# EAGLE design xr_vco_components_manual_rt1-V2 (EAGLE 7.3.0)
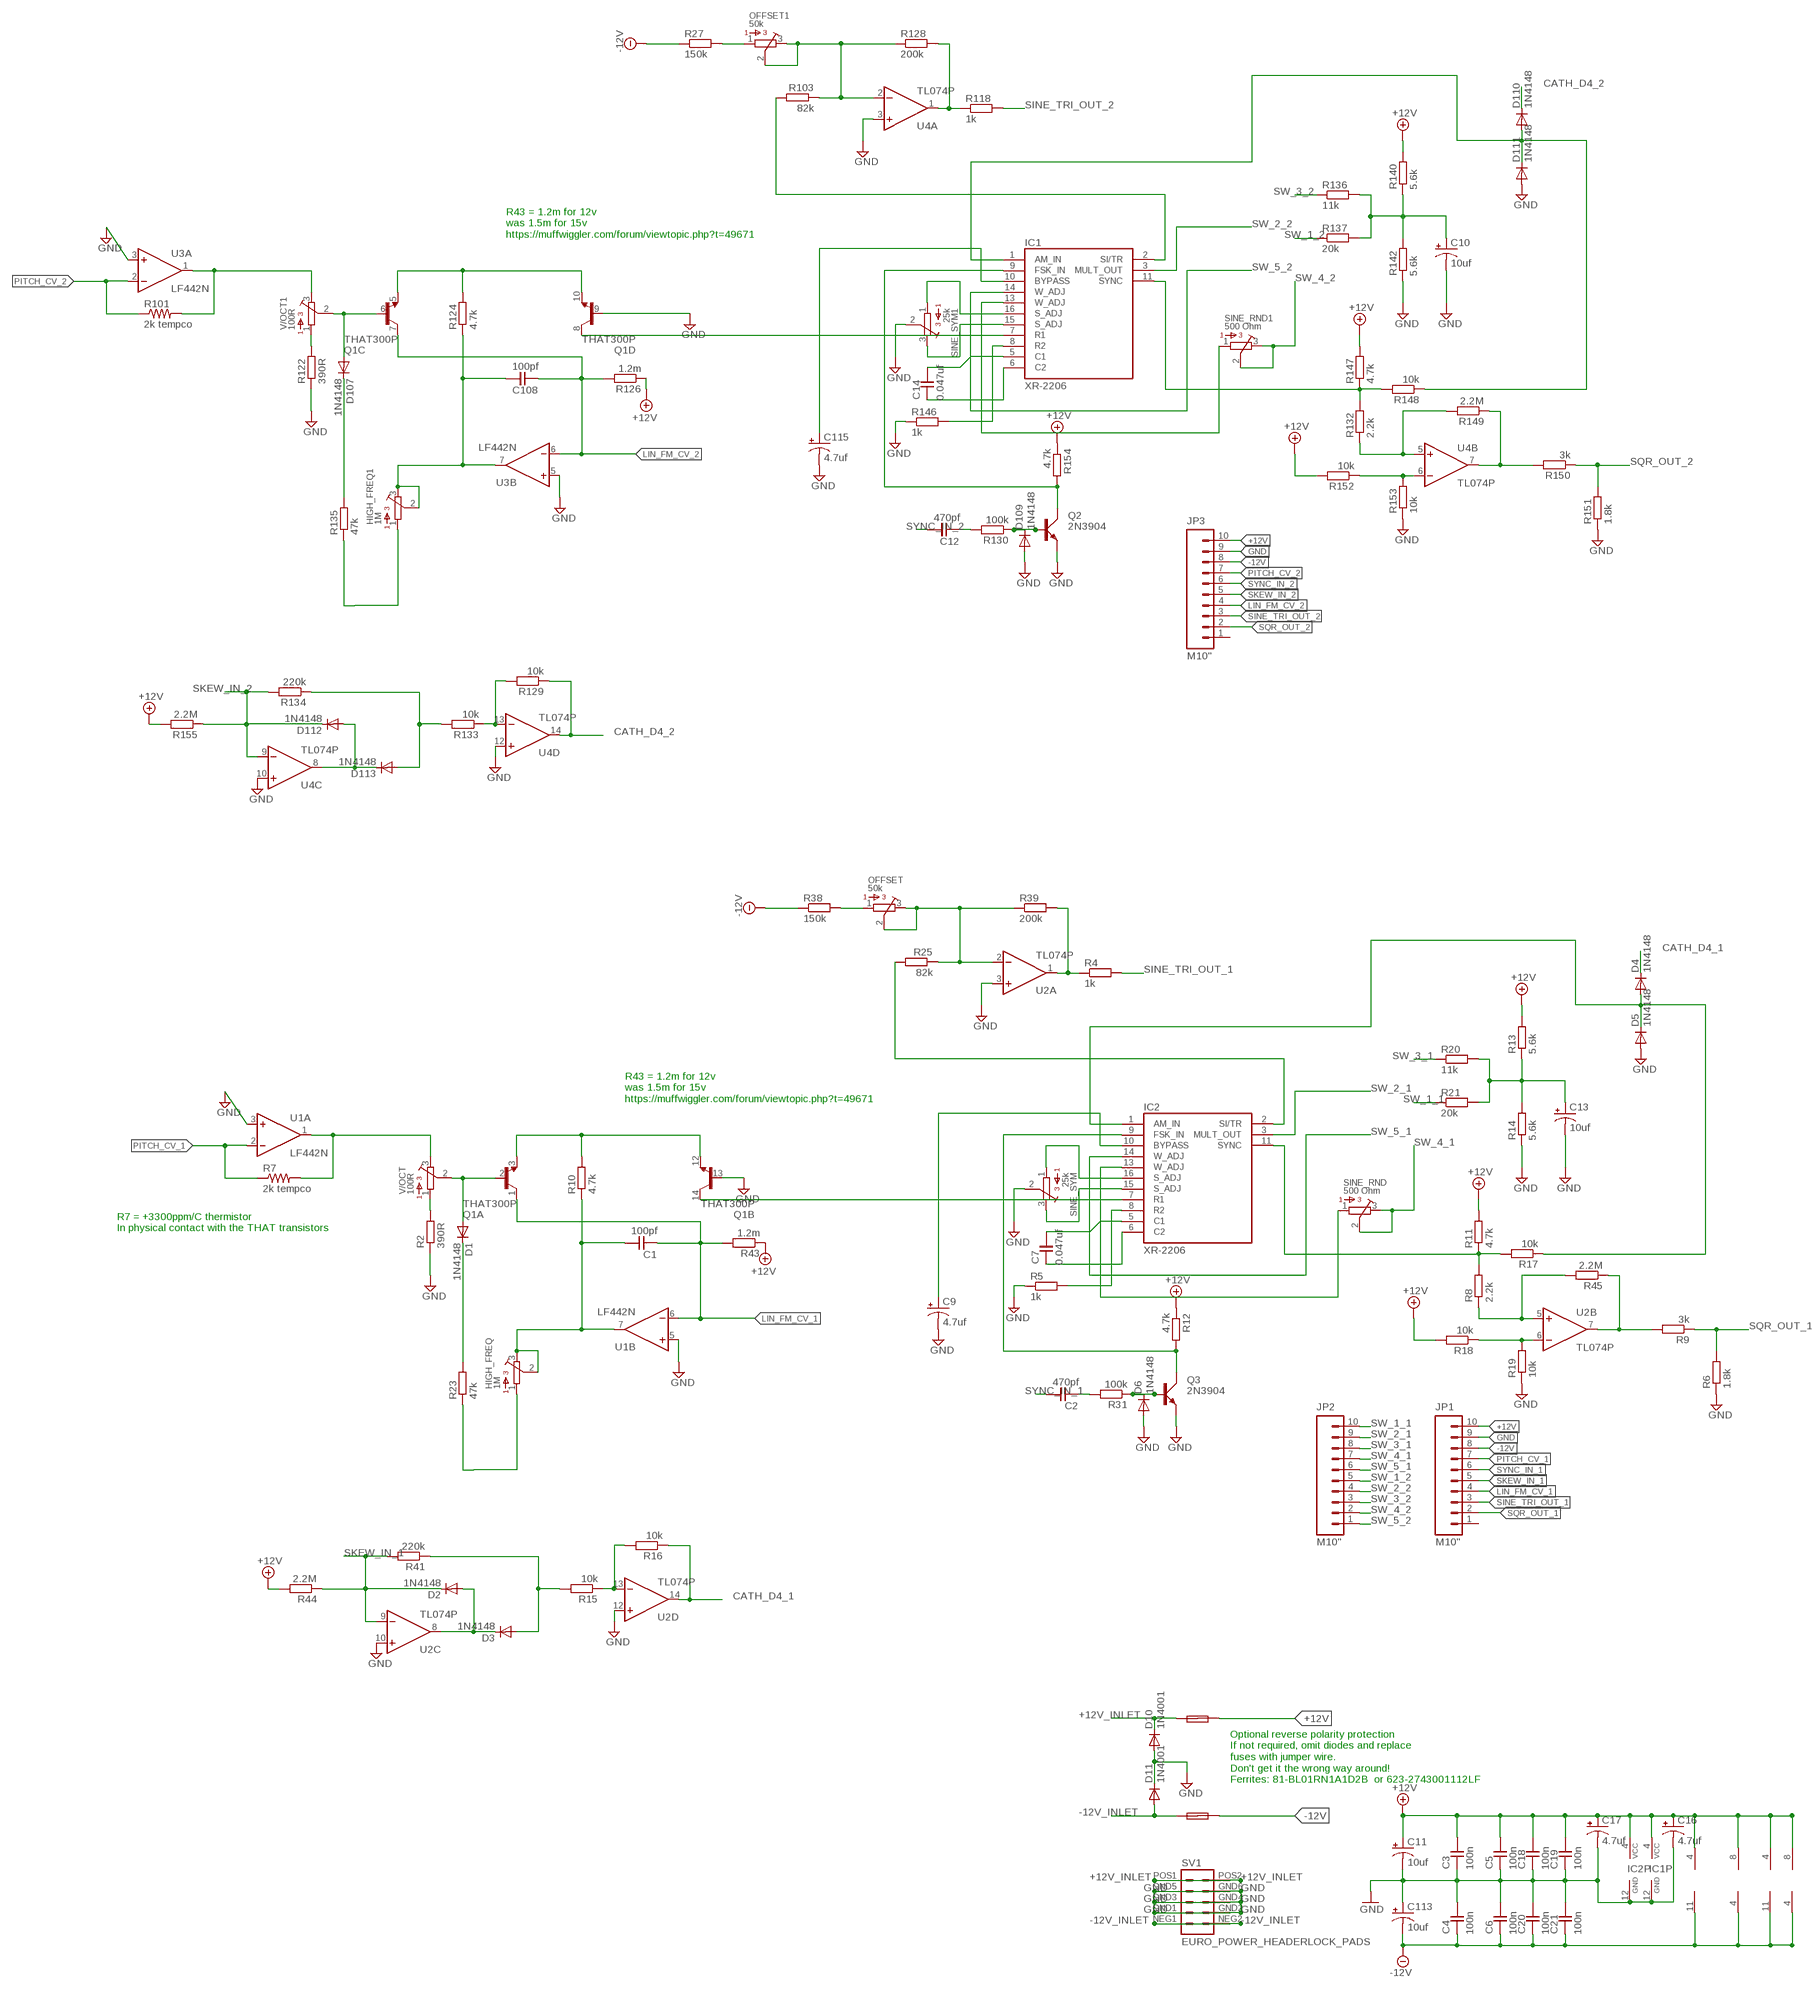
[diagram p0: schematic, sheet 1]

## Parts
C1  100pf  C-EU050-024X044  [C050-024X044]
C2  470pf  C-EU050-024X044  [C050-024X044]
C3  100n  C-EU050-024X044  [C050-024X044]
C4  100n  C-EU050-024X044  [C050-024X044]
C5  100n  C-EU050-024X044  [C050-024X044]
C6  100n  C-EU050-024X044  [C050-024X044]
C7  0.047uf  C-EU050-024X044  [C050-024X044]
C9  4.7uf  CAP_POLPTH2  [CPOL-RADIAL-10UF-25V]
C10  10uf  CAP_POLPTH2  [CPOL-RADIAL-10UF-25V]
C11  10uf  CAP_POLPTH2  [CPOL-RADIAL-10UF-25V]
C12  470pf  C-EU050-024X044  [C050-024X044]
C13  10uf  CAP_POLPTH2  [CPOL-RADIAL-10UF-25V]
C14  0.047uf  C-EU050-024X044  [C050-024X044]
C16  4.7uf  CAP_POLPTH2  [CPOL-RADIAL-10UF-25V]
C17  4.7uf  CAP_POLPTH2  [CPOL-RADIAL-10UF-25V]
C18  100n  C-EU050-024X044  [C050-024X044]
C19  100n  C-EU050-024X044  [C050-024X044]
C20  100n  C-EU050-024X044  [C050-024X044]
C21  100n  C-EU050-024X044  [C050-024X044]
C108  100pf  C-EU050-024X044  [C050-024X044]
C113  10uf  CAP_POLPTH2  [CPOL-RADIAL-10UF-25V]
C115  4.7uf  CAP_POLPTH2  [CPOL-RADIAL-10UF-25V]
D1  1N4148  SMALL_DIODEDO35-7  [DO35-7]
D2  1N4148  SMALL_DIODEDO35-7  [DO35-7]
D3  1N4148  SMALL_DIODEDO35-7  [DO35-7]
D4  1N4148  SMALL_DIODEDO35-7  [DO35-7]
D5  1N4148  SMALL_DIODEDO35-7  [DO35-7]
D6  1N4148  SMALL_DIODEDO35-7  [DO35-7]
D10  1N4001  1N4004  [DO41-10]
D11  1N4001  1N4004  [DO41-10]
D107  1N4148  SMALL_DIODEDO35-7  [DO35-7]
D109  1N4148  SMALL_DIODEDO35-7  [DO35-7]
D110  1N4148  SMALL_DIODEDO35-7  [DO35-7]
D111  1N4148  SMALL_DIODEDO35-7  [DO35-7]
D112  1N4148  SMALL_DIODEDO35-7  [DO35-7]
D113  1N4148  SMALL_DIODEDO35-7  [DO35-7]
F1  FUSE  PTC_FUSEPOLY_FUSE  [C050H075X075]
F2  FUSE  PTC_FUSEPOLY_FUSE  [C050H075X075]
HIGH_FREQ  1M  BOURNS_3362P_TRIMMERP  [BOURNS_3362P_TRIMMER]
HIGH_FREQ1  1M  BOURNS_3362P_TRIMMERP  [BOURNS_3362P_TRIMMER]
IC1  XR-2206  [DIL16]
IC2  XR-2206  [DIL16]
JP1  M10"  [1X10]
JP2  M10"  [1X10]
JP3  M10"  [1X10]
OFFSET  50k  BOURNS_3362P_TRIMMERP  [BOURNS_3362P_TRIMMER]
OFFSET1  50k  BOURNS_3362P_TRIMMERP  [BOURNS_3362P_TRIMMER]
Q1  THAT300P  [DIL14]
Q2  2N3904  [TO92D]
Q3  2N3904  [TO92D]
R2  390R  RESISTOR7MM  [7MM_RESISTOR]
R4  1k  RESISTOR7MM  [7MM_RESISTOR]
R5  1k  RESISTOR7MM  [7MM_RESISTOR]
R6  1.8k  RESISTOR7MM  [7MM_RESISTOR]
R7  2k tempco  R-US_0309/12  [0309/12]
R8  2.2k  RESISTOR7MM  [7MM_RESISTOR]
R9  3k  RESISTOR7MM  [7MM_RESISTOR]
R10  4.7k  RESISTOR7MM  [7MM_RESISTOR]
R11  4.7k  RESISTOR7MM  [7MM_RESISTOR]
R12  4.7k  RESISTOR7MM  [7MM_RESISTOR]
R13  5.6k  RESISTOR7MM  [7MM_RESISTOR]
R14  5.6k  RESISTOR7MM  [7MM_RESISTOR]
R15  10k  RESISTOR7MM  [7MM_RESISTOR]
R16  10k  RESISTOR7MM  [7MM_RESISTOR]
R17  10k  RESISTOR7MM  [7MM_RESISTOR]
R18  10k  RESISTOR7MM  [7MM_RESISTOR]
R19  10k  RESISTOR7MM  [7MM_RESISTOR]
R20  11k  RESISTOR7MM  [7MM_RESISTOR]
R21  20k  RESISTOR7MM  [7MM_RESISTOR]
R23  47k  RESISTOR7MM  [7MM_RESISTOR]
R25  82k  RESISTOR7MM  [7MM_RESISTOR]
R27  150k  RESISTOR7MM  [7MM_RESISTOR]
R31  100k  RESISTOR7MM  [7MM_RESISTOR]
R38  150k  RESISTOR7MM  [7MM_RESISTOR]
R39  200k  RESISTOR7MM  [7MM_RESISTOR]
R41  220k  RESISTOR7MM  [7MM_RESISTOR]
R43  1.2m  RESISTOR7MM  [7MM_RESISTOR]
R44  2.2M  RESISTOR7MM  [7MM_RESISTOR]
R45  2.2M  RESISTOR7MM  [7MM_RESISTOR]
R101  2k tempco  R-US_0309/12  [0309/12]
R103  82k  RESISTOR7MM  [7MM_RESISTOR]
R118  1k  RESISTOR7MM  [7MM_RESISTOR]
R122  390R  RESISTOR7MM  [7MM_RESISTOR]
R124  4.7k  RESISTOR7MM  [7MM_RESISTOR]
R126  1.2m  RESISTOR7MM  [7MM_RESISTOR]
R128  200k  RESISTOR7MM  [7MM_RESISTOR]
R129  10k  RESISTOR7MM  [7MM_RESISTOR]
R130  100k  RESISTOR7MM  [7MM_RESISTOR]
R132  2.2k  RESISTOR7MM  [7MM_RESISTOR]
R133  10k  RESISTOR7MM  [7MM_RESISTOR]
R134  220k  RESISTOR7MM  [7MM_RESISTOR]
R135  47k  RESISTOR7MM  [7MM_RESISTOR]
R136  11k  RESISTOR7MM  [7MM_RESISTOR]
R137  20k  RESISTOR7MM  [7MM_RESISTOR]
R140  5.6k  RESISTOR7MM  [7MM_RESISTOR]
R142  5.6k  RESISTOR7MM  [7MM_RESISTOR]
R146  1k  RESISTOR7MM  [7MM_RESISTOR]
R147  4.7k  RESISTOR7MM  [7MM_RESISTOR]
R148  10k  RESISTOR7MM  [7MM_RESISTOR]
R149  2.2M  RESISTOR7MM  [7MM_RESISTOR]
R150  3k  RESISTOR7MM  [7MM_RESISTOR]
R151  1.8k  RESISTOR7MM  [7MM_RESISTOR]
R152  10k  RESISTOR7MM  [7MM_RESISTOR]
R153  10k  RESISTOR7MM  [7MM_RESISTOR]
R154  4.7k  RESISTOR7MM  [7MM_RESISTOR]
R155  2.2M  RESISTOR7MM  [7MM_RESISTOR]
SINE_RND  500 Ohm  BOURNS_3362P_TRIMMERP  [BOURNS_3362P_TRIMMER]
SINE_RND1  500 Ohm  BOURNS_3362P_TRIMMERP  [BOURNS_3362P_TRIMMER]
SINE_SYM  25k  BOURNS_3362P_TRIMMERP  [BOURNS_3362P_TRIMMER]
SINE_SYM1  25k  BOURNS_3362P_TRIMMERP  [BOURNS_3362P_TRIMMER]
SV1  EURO_POWER_HEADERLOCK_PADS  [EURO_PWR_HEADER_LOCK]
U1  LF442N  [DIL08]
U2  TL074P  [DIL14]
U3  LF442N  [DIL08]
U4  TL074P  [DIL14]
V/OCT  100R  BOURNS_3362P_TRIMMERP  [BOURNS_3362P_TRIMMER]
V/OCT1  100R  BOURNS_3362P_TRIMMERP  [BOURNS_3362P_TRIMMER]

## Nets
+12V: C3.1 C5.1 C11.1(+) C16.1(+) C17.1(+) C18.1 C19.1 F1.2 IC1.4(VCC) IC2.4(VCC) JP1.10 JP3.10 R11.2 R12.1 R13.2 R18.2 R43.1 R44.2 R126.1 R140.2 R147.2 R152.2 R154.1 R155.2 U1.8(P:V+) U2.4(P:V+) U3.8(P:V+) U4.4(P:V+)
+12V_INLET [power]: D10.C F1.1 SV1.POS1 SV1.POS2
-12V: C4.2 C6.2 C20.2 C21.2 C113.2(-) F2.2 JP1.8 JP3.8 R27.1 R38.1 U1.4(P:V-) U2.11(P:V-) U3.4(P:V-) U4.11(P:V-)
-12V_INLET [power]: D11.A F2.1 SV1.NEG1 SV1.NEG2
CATH_D4_1: D4.C R16.1 U2.14(D:OUT)
CATH_D4_2: D110.C R129.1 U4.14(D:OUT)
GND: C3.2 C4.1 C5.2 C6.1 C9.2(-) C10.2(-) C11.2(-) C13.2(-) C16.2(-) C17.2(-) C18.2 C19.2 C20.1 C21.1 C113.1(+) C115.2(-) D5.A D6.A D10.A D11.C D109.A D111.A IC1.12(GND) IC2.12(GND) JP1.9 JP3.9 Q1.9(D:B) Q1.13(B:B) Q2.E Q3.E R2.1 R5.1 R6.1 R14.1 R19.1 R122.1 R142.1 R146.1 R151.1 R153.1 SINE_SYM1.2 SINE_SYM.2 SV1.GND1 SV1.GND2 SV1.GND3 SV1.GND4 SV1.GND5 SV1.GND6 U1.3(A:+IN) U1.5(B:+IN) U2.3(A:+IN) U2.10(C:+IN) U2.12(D:+IN) U3.3(A:+IN) U3.5(B:+IN) U4.3(A:+IN) U4.10(C:+IN) U4.12(D:+IN)
LIN_FM_CV_1: C1.2 JP1.4 Q1.1(A:C) R43.2 U1.6(B:-IN)
LIN_FM_CV_2: C108.2 JP3.4 Q1.7(C:C) R126.2 U3.6(B:-IN)
N$1: IC2.7(R1) Q1.14(B:C)
N$2: D1.C R23.2
N$3: HIGH_FREQ.1 R23.1
N$4: R101.2 U3.1(A:OUT) V/OCT1.3
N$5: IC2.2(SI/TR) R25.2
N$6: R122.2 V/OCT1.1
N$7: R7.2 U1.1(A:OUT) V/OCT.3
N$8: OFFSET.2 OFFSET.3 R25.1 R39.1 U2.2(A:-IN)
N$9: R2.2 V/OCT.1
N$10: D1.A Q1.2(A:B) V/OCT.2
N$11: Q1.3(A:E) Q1.12(B:E) R10.2
N$12: OFFSET.1 R38.2
N$13: R4.1 R39.2 U2.1(A:OUT)
N$14: D107.A Q1.6(C:B) V/OCT1.2
N$15: C1.1 HIGH_FREQ.2 HIGH_FREQ.3 R10.1 U1.7(B:OUT)
N$16: C13.1(+) R13.1 R14.2 R20.2 R21.2
N$17: IC2.16(S_ADJ) SINE_SYM.1
N$18: Q1.5(C:E) Q1.10(D:E) R124.2
N$19: C108.1 HIGH_FREQ1.2 HIGH_FREQ1.3 R124.1 U3.7(B:OUT)
N$20: IC2.13(W_ADJ) SINE_RND.1
N$21: IC2.15(S_ADJ) SINE_SYM.3
N$22: IC2.8(R2) R5.2
N$23: R18.1 R19.2 U2.6(B:-IN)
N$24: R9.2 R45.1 U2.7(B:OUT)
N$25: R15.1 R16.2 U2.13(D:-IN)
N$26: R8.1 R45.2 U2.5(B:+IN)
N$27: D4.A D5.C IC2.1(AM_IN) R17.1
N$28: C2.2 R31.2
N$29: D6.C Q3.B R31.1
N$30: IC2.11(SYNC) R8.2 R11.1 R17.2
N$31: IC2.9(FSK_IN) Q3.C R12.2
N$32: C7.2 IC2.6(C2)
N$33: C7.1 IC2.5(C1)
N$34: C9.1(+) IC2.10(BYPASS)
N$35: D2.A D3.C U2.8(C:OUT)
N$36: D3.A R15.2 R41.1
N$37: IC1.7(R1) Q1.8(D:C)
N$38: HIGH_FREQ1.1 R135.1
N$39: D107.C R135.2
N$40: IC1.2(SI/TR) R103.2
N$41: OFFSET1.2 OFFSET1.3 R103.1 R128.1 U4.2(A:-IN)
N$42: OFFSET1.1 R27.2
N$43: R118.1 R128.2 U4.1(A:OUT)
N$44: C10.1(+) R136.2 R137.2 R140.1 R142.2
N$45: IC1.13(W_ADJ) SINE_RND1.1
N$46: IC1.16(S_ADJ) SINE_SYM1.1
N$47: IC1.15(S_ADJ) SINE_SYM1.3
N$48: IC1.8(R2) R146.2
N$49: R152.1 R153.2 U4.6(B:-IN)
N$50: R149.1 R150.2 U4.7(B:OUT)
N$51: R132.1 R149.2 U4.5(B:+IN)
N$52: IC1.11(SYNC) R132.2 R147.1 R148.2
N$53: D110.A D111.C IC1.1(AM_IN) R148.1
N$54: C12.2 R130.2
N$55: D109.C Q2.B R130.1
N$56: IC1.9(FSK_IN) Q2.C R154.2
N$57: C14.2 IC1.6(C2)
N$58: C14.1 IC1.5(C1)
N$59: R129.2 R133.1 U4.13(D:-IN)
N$60: D112.A D113.C U4.8(C:OUT)
N$61: D113.A R133.2 R134.1
N$62: C115.1(+) IC1.10(BYPASS)
PITCH_CV_1: JP1.7 R7.1 U1.2(A:-IN)
PITCH_CV_2: JP3.7 R101.1 U3.2(A:-IN)
SINE_TRI_OUT_1: JP1.3 R4.2
SINE_TRI_OUT_2: JP3.3 R118.2
SKEW_IN_1: D2.C JP1.5 R41.2 R44.1 U2.9(C:-IN)
SKEW_IN_2: D112.C JP3.5 R134.2 R155.1 U4.9(C:-IN)
SQR_OUT_1: JP1.2 R6.2 R9.1
SQR_OUT_2: JP3.2 R150.1 R151.2
SW_1_1: JP2.10 R21.1
SW_1_2: JP2.5 R137.1
SW_2_1: IC2.3(MULT_OUT) JP2.9
SW_2_2: IC1.3(MULT_OUT) JP2.4
SW_3_1: JP2.8 R20.1
SW_3_2: JP2.3 R136.1
SW_4_1: JP2.7 SINE_RND.2 SINE_RND.3
SW_4_2: JP2.2 SINE_RND1.2 SINE_RND1.3
SW_5_1: IC2.14(W_ADJ) JP2.6
SW_5_2: IC1.14(W_ADJ) JP2.1
SYNC_IN_1: C2.1 JP1.6
SYNC_IN_2: C12.1 JP3.6
Unconnected: JP1.1 JP3.1

## Notes on the sheet
- R43 = 1.2m for 12v
  was 1.5m for 15v
  https://muffwiggler.com/forum/viewtopic.php?t=49671
- R43 = 1.2m for 12v
  was 1.5m for 15v
  https://muffwiggler.com/forum/viewtopic.php?t=49671
- R7 = +3300ppm/C thermistor
  In physical contact with the THAT transistors
- Optional reverse polarity protection
  If not required, omit diodes and replace
  fuses with jumper wire. 
  Don't get it the wrong way around! 
  Ferrites: 81-BL01RN1A1D2B  or 623-2743001112LF

## Library data of the parts
C1-C7 C12 C14 C18-C21 C108 = TomW:C-EU: CAPACITOR, European symbol
C9-C11 C13 C16 C17 C113 C115 = SparkFun-Passives:CAP_POL: Capacitor Polarized These are standard SMD and PTH capacitors. Normally 10uF, 47uF, and 100uF in electrolytic and tantalum varieties. Always verify the external diameter of the through hole cap, it varies with capacity, voltage, and manufacturer. The EIA devices should be standard.
D1-D6 D107 D109-D113 = MusicThingModular:SMALL_DIODE: Small Signal Diode
D10 D11 = diode:1N4004: DIODE general purpose rectifier, 1 A
F1 F2 = TomW:PTC_FUSE
HIGH_FREQ HIGH_FREQ1 OFFSET OFFSET1 SINE_RND SINE_RND1 SINE_SYM SINE_SYM1 V/OCT V/OCT1 = MusicThingModular:BOURNS_3362P_TRIMMER: 3362 Series 1/4" Square Trimmer
IC1 IC2 = exar:XR-2206: Monolithic FUNCTION GENERATOR; OC_FARNELL: unknown; OC_NEWARK: unknown
JP1-JP3 = SparkFun-Connectors:M10: Header 10 Standard 10-pin 0.1" header. Use with straight break away headers (SKU : PRT-00116), right angle break away headers (PRT-00553), swiss pins (PRT-00743), machine pins (PRT-00117), and female headers (PRT-00115).
Q1 = that-corp:THAT300: 4-Matched NPN Transistors
Q2 Q3 = transistor-small-signal:2N3904: NPN TRANSISTOR
R2 R4-R6 R8-R21 R23 R25 R27 R31 R38 R39 R41 R43-R45 R103 R118 R122 R124 R126 R128-R130 R132-R137 R140 R142 R146-R155 = MusicThingModular:RESISTOR: Standard resistor, various versions
R7 R101 = resistor:R-US_: RESISTOR, American symbol
SV1 = MusicThingModular:EURO_POWER_HEADER: Power Header 10 pin power header for Eurorack Power Supplies Variants with fatter pads for easier soldering, and the LOCK variant which has 5mil offset pins to hold the component in place before soldering
U1 U3 = linear:LF442: OP AMP
U2 U4 = linear:TL074: OP AMP

## Net classes
1 power: width 0.406 mm
2 ground: width 0.305 mm

## Board
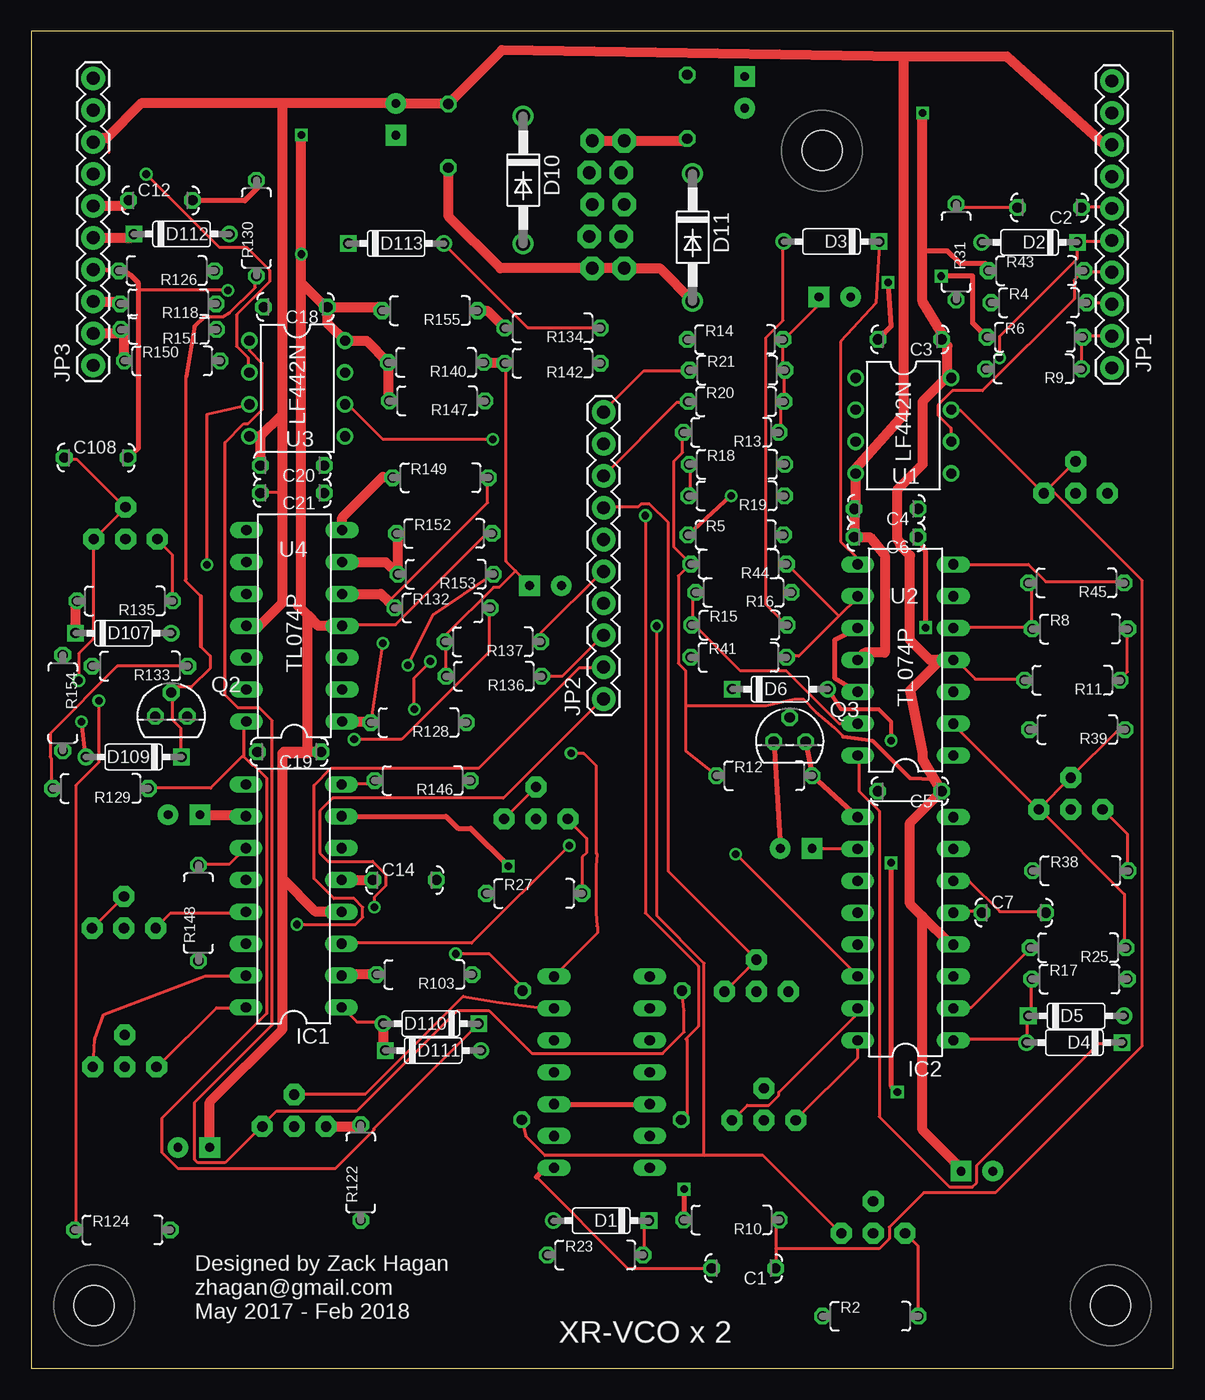
[diagram p1: board, top side]
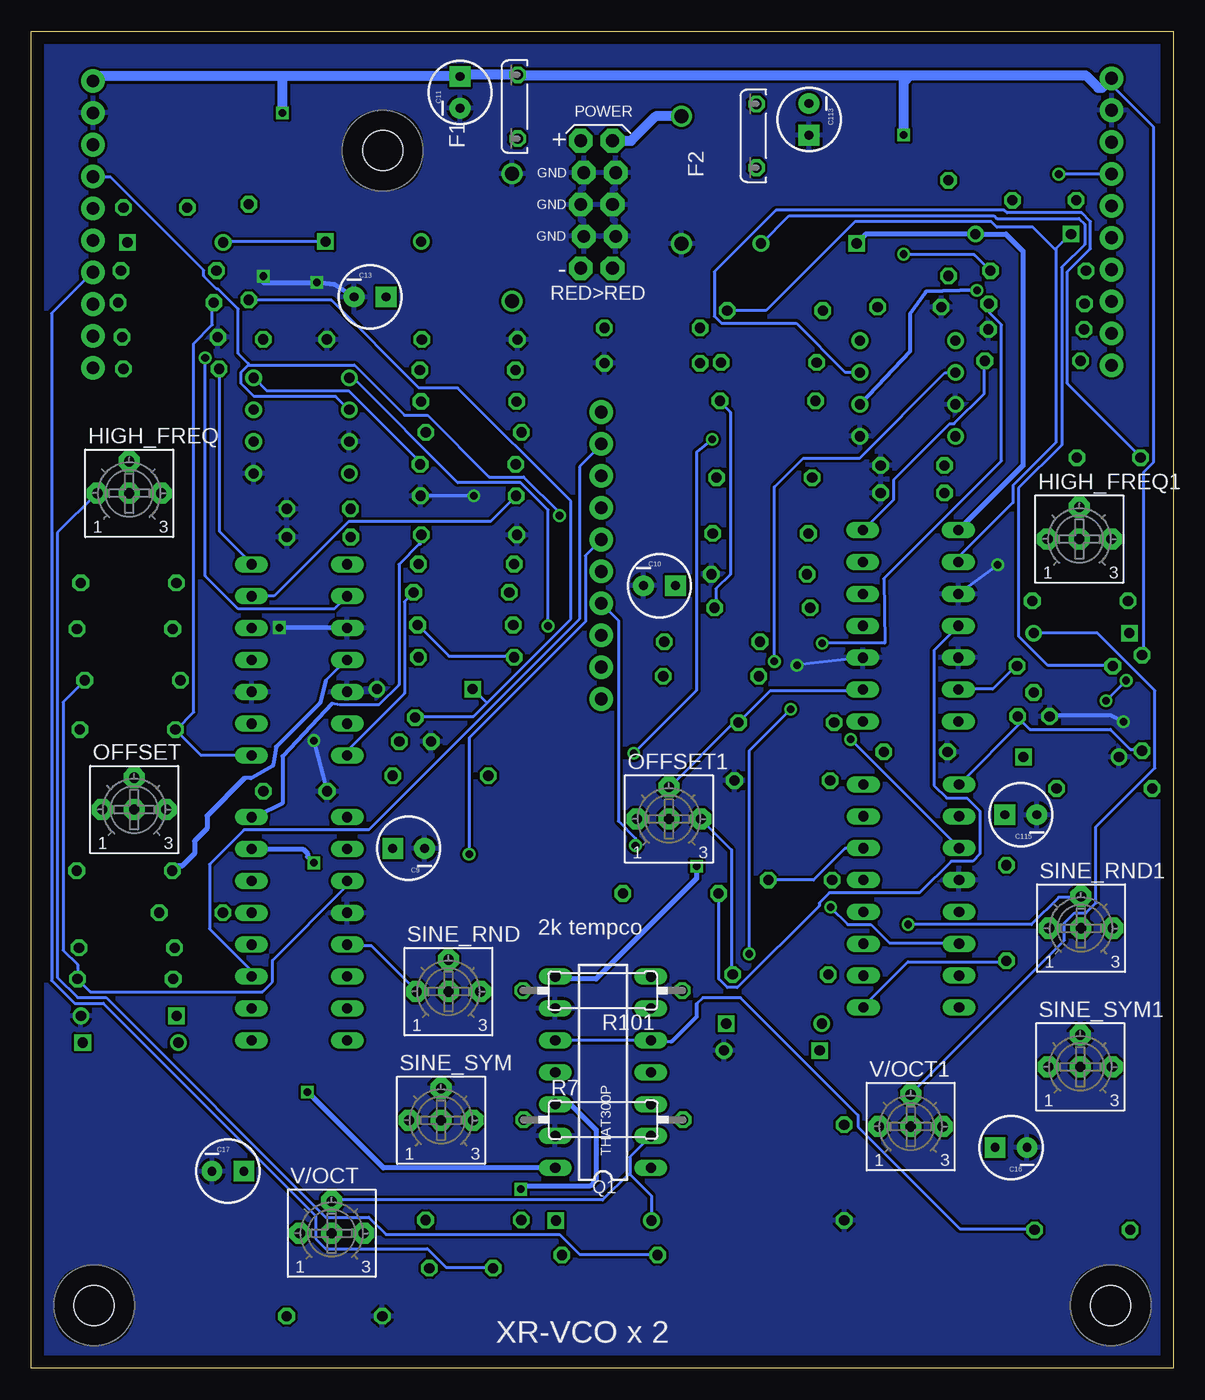
[diagram p2: board, bottom side, seen from below]

Size 91 x 106.5 mm. Coordinates in mm from the lower left corner, seen from the top.
Outline: 0,0 91,0 91,106.5 0,106.5 0,0
Copper layers (1*16): Top 0.035mm / dielectric 1.5mm / Bottom 0.035mm
Design rules "default *": minimum track width 10mil, minimum drill 19mil, track to track 8mil, track to pad 8mil, pad to pad 8mil, via to via 8mil, smd to smd 8mil, copper to edge 40mil, drill to drill 8mil, minimum pad ring 10mil, minimum via ring 8mil, stop-mask expansion 4mil, vias tented up to drill 0mil, thermal gap 10mil

### Footprints (pad centres in the part's own frame; a part is rotated, then mirrored left to right if it is on the bottom)
C050-024X044 = drill 0.813 octagon: 1 -2.54,0; 2 2.54,0
CPOL-RADIAL-10UF-25V = drill 0.7 pad 1.651 square: 1 1.27,0 | drill 0.7 pad 1.651: 2 -1.27,0
DO35-7 = drill 0.813: A 3.81,0 | drill 0.813 square: C -3.81,0
DO41-10 = drill 1.118: A 5.08,0; C -5.08,0
C050H075X075 = drill 0.813 octagon: 1 -2.54,0; 2 2.54,0
BOURNS_3362P_TRIMMER = drill 0.813 pad 1.676 octagon: 1 -2.54,0; 2 0,2.54; 3 2.54,0; 4 0,0
DIL16 = drill 0.813 long: 1 -8.89,-3.81; 2 -6.35,-3.81; 3 -3.81,-3.81; 4 -1.27,-3.81; 5 1.27,-3.81; 6 3.81,-3.81; 7 6.35,-3.81; 8 8.89,-3.81; 9 8.89,3.81; 10 6.35,3.81; 11 3.81,3.81; 12 1.27,3.81; 13 -1.27,3.81; 14 -3.81,3.81; 15 -6.35,3.81; 16 -8.89,3.81
1X10 = drill 1.016 pad 1.88: 1 0,0; 2 2.54,0; 3 5.08,0; 4 7.62,0; 5 10.16,0; 6 12.7,0; 7 15.24,0; 8 17.78,0; 9 20.32,0; 10 22.86,0
DIL14 = drill 0.813 long: 1 -7.62,-3.81; 2 -5.08,-3.81; 3 -2.54,-3.81; 4 0,-3.81; 5 2.54,-3.81; 6 5.08,-3.81; 7 7.62,-3.81; 8 7.62,3.81; 9 5.08,3.81; 10 2.54,3.81; 11 0,3.81; 12 -2.54,3.81; 13 -5.08,3.81; 14 -7.62,3.81
TO92D = drill 0.813 octagon: B 0,1.905; C 1.27,0; E -1.27,0
7MM_RESISTOR = drill 0.813 octagon: 1 -3.81,0; 2 3.81,0
0309/12 = drill 0.813 octagon: 1 -6.35,0; 2 6.35,0
EURO_PWR_HEADER_LOCK = drill 1.016 pad 1.88 octagon: GND1 -2.54,1.143; GND2 -2.54,-1.397; GND3 0,1.397; GND4 0,-1.143; GND5 2.54,1.143; GND6 2.54,-1.397; NEG1 -5.08,1.397; NEG2 -5.08,-1.143; POS1 5.08,1.397; POS2 5.08,-1.143
DIL08 = drill 0.813 pad 1.27: 1 -3.81,-3.81; 2 -1.27,-3.81; 3 1.27,-3.81; 4 3.81,-3.81; 5 3.81,3.81; 6 1.27,3.81; 7 -1.27,3.81; 8 -3.81,3.81
MOUNTING_HOLE = hole 3.2: 0,0

### Placement (x,y rotation side)
C1  56.75,7.96 180 top
C2  81.12,92.46 180 top
C3  69.99,81.96 180 top
C4  68.11,68.46 180 top
C5  69.98,45.96 180 top
C6  68.1,66.21 180 top
C7  78.28,36.29 0 top
C9  60.94,41.41 180 bottom
C10  40.96,62.34 0 bottom
C11  56.84,101.64 90 bottom
C12  10.29,93.04 0 top
C13  64.01,85.34 0 bottom
C14  29.74,38.89 0 top
C16  12.94,17.58 180 bottom
C17  75.34,15.69 0 bottom
C18  21.04,84.54 180 top
C19  20.54,49.1 180 top
C20  20.79,71.91 180 top
C21  20.79,69.72 180 top
C108  5.16,72.54 0 top
C113  29.04,99.49 270 bottom
C115  12.16,44.09 180 bottom
D1  45.4,11.75 180 top
D2  79.53,89.69 180 top
D3  63.75,89.75 180 top
D4  83.1,25.94 180 top
D5  83.24,28.06 0 top
D6  59.65,54.1 0 top
D10  39.19,94.65 270 top
D11  52.69,90.1 270 top
D107  7.33,58.56 0 top
D109  8.15,48.69 180 top
D110  31.83,27.44 180 top
D111  32.01,25.31 0 top
D112  11.97,90.35 0 top
D113  29.06,89.6 0 top
F1  52.25,100.5 90 bottom
F2  33.22,98.18 90 bottom
HIGH_FREQ  83.2,69.7 0 bottom
HIGH_FREQ1  7.5,66.05 0 bottom
IC1  20.9,37.62 90 top
IC2  69.65,35.01 90 top
JP1  86.09,79.69 90 top
JP2  45.59,53.31 90 top
JP3  4.93,79.9 90 top
OFFSET  82.81,44.5 0 bottom
OFFSET1  40.2,43.75 0 bottom
Q1  45.45,23.57 90 bottom
Q2  11.14,51.92 0 top
Q3  60.42,49.92 0 top
R2  66.85,4.14 0 top
R4  80.28,84.89 0 top
R5  56.12,66.39 0 top
R6  79.96,82.14 0 top
R7  45.43,19.79 0 bottom
R8  83.55,58.89 0 top
R9  79.86,79.61 180 top
R10  55.78,11.8 180 top
R11  82.94,54.8 180 top
R12  58.4,47.2 0 top
R13  55.76,74.55 180 top
R14  56.08,81.95 0 top
R15  56.42,59.2 0 top
R16  56.74,61.8 180 top
R17  83.51,31 0 top
R18  56.22,72.01 0 top
R19  56.19,69.49 180 top
R20  56.15,77.01 0 top
R21  56.24,79.51 0 top
R23  44.92,9.01 0 top
R25  83.4,33.49 180 top
R27  40.06,37.82 0 top
R31  73.68,88.92 90 top
R38  83.58,39.63 0 top
R39  83.33,50.87 180 top
R41  56.35,56.63 0 top
R43  80.06,87.44 0 top
R44  56.35,64.06 180 top
R45  83.26,62.56 180 top
R101  45.49,30.08 180 bottom
R103  31.31,31.36 180 top
R118  10.9,84.8 180 top
R122  26.24,15.58 90 top
R124  7.26,11.01 0 top
R126  10.78,87.43 180 top
R128  30.85,51.43 180 top
R129  5.51,46.18 180 top
R130  17.93,90.83 90 top
R132  32.76,60.57 0 top
R133  8.65,55.93 180 top
R134  41.53,82.87 180 top
R135  7.44,61.12 180 top
R136  36.85,55.12 180 top
R137  36.76,57.87 180 top
R140  32.24,80.12 180 top
R142  41.53,80.06 180 top
R146  31.17,46.81 180 top
R147  32.33,77.06 180 top
R148  13.31,36.26 90 top
R149  32.6,70.94 0 top
R150  11.22,80.25 0 top
R151  10.94,82.75 180 top
R152  32.9,66.5 0 top
R153  33.01,63.25 180 top
R154  2.5,53 270 top
R155  31.75,84.25 180 top
SINE_RND  57.77,30 0 bottom
SINE_RND1  7.37,35.05 0 bottom
SINE_SYM  58.36,19.75 0 bottom
SINE_SYM1  7.43,24 0 bottom
SV1  45.84,92.71 90 bottom
U1  69.48,75.09 270 top
U2  69.65,56.42 90 top
U3  21.18,78.05 270 top
U4  20.95,59.14 90 top
U$1  [MOUNTING_HOLE]  63,97 0 top
U$2  [MOUNTING_HOLE]  5,5 0 top
U$3  [MOUNTING_HOLE]  86,5 0 top
V/OCT  67.07,10.75 0 bottom
V/OCT1  20.94,19.25 0 bottom

### Tracks (layer width: path | path; a pad name or v marks a point on that pad's centre or on a via)
+12V  (via drill 0.6)
  Top 0.254: 52.12,52.76 52.12,55.58 51.55,56.15 51.55,63.12 52.46,64.04 R44.2 52.46,64.15 51.21,65.41 51.21,72.27 51.89,72.95 51.89,74.44 R13.2 | 52.12,52.76 52.12,49.18 R12.1 | R152.2 36.69,66.44 36.23,66.44 29.03,59.24 25.15,59.24 U4.4 | R11.2 79.1,54.89 75.21,54.89 73.84,56.26 U2.4 | 52.12,52.76 58.53,52.76 60.76,53.28 61.54,53.28 62.52,52.26 64.01,51.01 64.69,50.32
  Top 0.305: 64.69,50.32 67,50 70,47 71.92,46.95
  Top 0.406: R43.1 76.25,87.75 76,88 74,88 73,89 71,89
  Top 0.813: C18.1 23.46,84.54 21.5,86.5 | 21.5,86.5 v21.5,88.75 v21.5,98.25 | U4.4 22.86,59.14 22,60 | 22,60 21.5,60.5 | 21.25,60.75 21.5,60.5 | 21.5,60.5 21.5,86.5 | IC1.4 22.65,36.35 20,39 | 20,39 20,49 | C18.1 23.58,83.27 U3.8 26.69,81.86 R140.2 28.43,77.15 R147.2 | C18.1 27.65,84.54 R155.2 | C19.1 20.1,49.1 20,49 | C16.1 14.21,21.21 20,27 20,39 | U1.8 73.1,78.9 73,79 | 73,79 73,81.43 C3.1 72.53,82.47 71,85 71,89 v71,100 | 73,79 71,77 71,72 69,70 69,66 69.25,65.75 69.25,65.5 70,64.75 70,58 71.58,56.42 U2.4 72.42,56.42 70,54 71,49 71,48.48 71.92,46.95 C5.1 70,43.44 70,37 71,36 | IC2.4 73.26,33.74 71,36 | C17.1 74.07,15.93 71,19 71,36 | 20,49 22,49 22,60
  Bottom 0.254: R154.1 2.4,56.84 2.4,71.35 1.6,72.15 1.6,98.9 4.92,102.21 JP3.10 | R18.2 60.12,72.04 60.12,72.27 65.72,77.87 72.24,77.87 73.27,78.9 U1.8 | v21.5,88.75 16.02,88.75 arc45 15.84,88.68 R126.1
  Bottom 0.813: 21,103 52,103 52.04,103.04 F1.2 56.71,103.04 C11.1 71,102.91 | 21,103 7,103 6,102 5.69,102 JP3.10 | 71,102.91 85.73,102.91 JP1.10 | v21.5,98.25 21.5,102.5 21,103 | v71,100 71,102.91
+12V_INLET
  Top 0.813: SV1.POS2 SV1.POS1 52.08,97.79 F1.1
  Bottom 0.813: SV1.POS2 43.21,97.79 41.27,99.73 D10.C | 52.08,97.79 F1.1
-12V
  Top 0.254: 20,69.75 18.29,69.75 C21.2 | 6.17,96.84 6.17,97.64 6,98
  Top 0.813: 20,100.76 C113.2 29.08,100.72 F2.2 37.5,105 69.5,104.5 | 20,100.76 8.76,100.76 6,98 5.25,98 JP3.8 | JP1.8 85.53,97.47 77.75,104.5 69.5,104.5 | U3.4 18,74.24 | 18,74.24 18.24,74.24 20,76 | 20,76 20,100.76 | C20.2 18.25,73.99 18,74.24 | U4.11 18.14,59.14 20,61 20,69.75 20,76 | 69.5,104.5 69.5,76 65.67,71.67 U1.4 65.67,68.56 C4.2 C6.2 66.79,66.21 68,64.75 68,57 66.42,57 U2.11
  Bottom 0.254: R27.1 36.23,37.75 36.23,31 35.55,30.32 34.75,30.32 28.23,36.83 28.23,37.06 27.43,37.86 20.23,37.86 17.72,40.38 16,40.38 15.43,40.95 15.43,44.38 16.46,45.41 18.06,45.41 19.09,46.43 19.09,57.18 17.14,59.12 U4.11 | 67.55,54.78 65.95,56.38 U2.11 | 79.67,39.69 R38.1
  Bottom 0.305: 67.55,54.78 68,53 71.5,49.5 71.75,48 73.5,47 74,47
  Bottom 0.406: 74,47 77,44 77,43 78,42 78,41 79,40 79.4,40 R38.1
-12V_INLET
  Top 0.813: D11.A 50.08,87.63 SV1.NEG1 SV1.NEG2 37.37,87.63 33.25,91.75 33.25,95.61 F2.1
CATH_D4_1
  Top 0.254: D4.C 86.87,25.86 85.04,25.86 75.32,16.14 75.32,14.77 74.98,14.43 73.15,14.43 67.55,20.03 67.55,44.38 65.95,45.98 65.95,48.72 U2.14
  Bottom 0.254: U2.14 65.84,48.84 65.84,49.18 61.27,53.75 61.27,61.06 60.58,61.75 R16.1
CATH_D4_2
  Top 0.254: 16.92,48.72 17.6,48.03 17.72,48.03 18.75,47.01 18.75,28.26 10.4,19.92 10.4,17.17 11.66,15.92 24.23,15.92 27.32,19 27.32,19.12 35.55,27.35 D110.C | 16.92,48.72 16.92,51.35 17.03,51.46 U4.14 | R129.1 9.37,46.21 14.29,46.21 16.8,48.72 16.92,48.72
GND  (via drill 0.6)
  Top 0.254: v14,64 14,76 U3.3 | v30,56 32,60 R153.1
  Top 0.305: D6.A 64.5,52.5 67.5,52.5 68.5,51.5 v68.5,50 | R5.1 v55.75,69.5 | D109.A v4,51.5
  Top 0.406: v68.25,86.5 68.5,83.01 C3.2 | R6.1 76.11,82.14 75,83.25 75,87 v72.5,87 | v71.25,59 71.25,65 C6.1 | U2.10 64,58 64,55 U2.12 | Q3.E C9.2
  Bottom 0.254: SV1.GND1 46.98,90.21 46.93,90.22 | 44.58,90.21 SV1.GND2 | U4.10 v14,64 | U4.3 v30,56
  Bottom 0.305: v68.5,50 C5.2 | v55.75,69.5 R19.1 | v4,51.5 5,52 10,52
  Bottom 0.406: C13.2 66.84,86.34 v68.25,86.5 72.5,86.5 v72.5,87 | U2.10 v71.25,59
  pour Bottom: -3,111 -3,-2 95,-2 95,-1 95,111
LIN_FM_CV_1
  Top 0.254: 40.23,15.23 47.55,7.92 54.18,7.92 C1.2 | U1.6 73.27,73.87 73.27,74.89 72.24,75.92 72.24,76.72 73.38,77.87 75.78,77.87 83.1,85.18 83.1,86.67 83.78,87.35 R43.2 83.9,87.35 86.07,87.35 JP1.4
  Top 0.406: Q1.1 40.95,15.95 40.23,15.23
  Bottom 0.254: C1.2 54.29,8.03 57.95,8.03 59.44,9.52 67.55,9.52 68.35,10.32 68.35,12.14 85.27,29.06 87.55,29.06 89.38,30.89 89.38,84.04 86.18,87.24 JP1.4
LIN_FM_CV_2  (via drill 0.6, 0.61)
  Top 0.254: v15.66,85.87 8.5,85.87 | U3.6 25.11,76.78 arc-45 25.29,76.71 28,74 v36.75,74 | v43,49 43.9,49 arc-45 44.07,48.93 45,48 45,41.1 arc45 45.07,40.93 45,40 45,36.25 45.05,35.25 arc45 45.13,35.18 45.13,34.68 Q1.7
  Top 0.406: JP3.4 R126.2 arc-40 8,87 8.5,86.5 8.5,85.87 8.5,73.25 C108.2
  Bottom 0.254: 24.69,76.84 24.92,76.84 U3.6 | v36.75,74 38,73 38,54.1 arc45 38.07,53.93 v43,49
  Bottom 0.305: v15.66,85.87 19.75,85.75 21,84 21,81 U3.6
N$1  (via drill 0.6)
  Top 0.406: v68.5,40.25 68.5,22.5 v69,22
  Bottom 0.406: IC2.7 69.36,41.36 69,41 69,40.75 v68.5,40.25 | Q1.14 62.95,15.95 v69,22
N$2
  Top 0.254: R23.2 48.81,9.06 48.81,11.34 49.15,11.69 D1.C
N$3
  Bottom 0.254: R23.1 41.15,9.06 47.32,9.06 48.92,10.66 62.75,10.66 64.12,12.03 67.55,12.03 85.04,29.52 87.33,29.52 88.92,31.12 88.92,66.55 85.84,69.64 HIGH_FREQ.1
N$4
  Top 0.254: R101.2 52.01,28.49 52.01,26.77 50.29,25.06 39.89,25.06 36.46,28.49 33.95,28.49 25.95,20.49 19.55,20.49 18.4,19.34 V/OCT1.3 18.29,19.23 15.43,16.37 13.26,16.37 13.03,16.6 13.03,21.17 19.2,27.35 19.2,51.58 18.17,52.61 16.46,52.61 15.43,53.63 15.43,73.75 16.92,75.24 17.26,75.24 18.4,76.38 18.4,80.04 17.37,81.07 17.37,81.75 U3.1
N$5
  Top 0.254: IC2.2 73.5,28.72 74.87,28.72 79.55,33.4 R25.2
N$6
  Top 0.813: V/OCT1.1 26.1,19.25 R122.2
N$7  (via drill 0.61)
  Top 0.254: 53.61,16.95 58.29,16.95 64.47,10.77 V/OCT.3 | 53.61,16.95 40.92,16.95 39.43,18.43 R7.2 | v49.84,59.12 49.84,36.03 53.61,32.26 53.61,16.95
  Bottom 0.254: v49.84,59.12 49.84,68.38 52.01,70.55 57.04,70.55 65.38,78.9 65.61,78.9 U1.1
N$8
  Top 0.254: R39.1 87.1,50.78 86.53,50.78 82.87,47.12 OFFSET.2 82.75,47.01 80.35,44.61 OFFSET.3 | R25.1 87.1,33.52 87.1,37.75 80.35,44.49 OFFSET.3 | U2.2 73.5,51.23 80.24,44.49 OFFSET.3
N$9
  Top 0.254: R2.2 70.64,4.14 70.64,9.74 69.72,10.66 V/OCT.1
N$10
  Bottom 0.254: 43.32,15.46 41.6,13.74 41.6,11.8 D1.A | 43.32,15.46 43.32,16.83 41.72,18.43 Q1.2 | V/OCT.2 66.98,13.4 45.49,13.4 43.43,15.46 43.32,15.46
N$11  (via drill 0.6)
  Top 0.406: Q1.3 Q1.12 | v52,14.25 52,11.83 R10.2
  Bottom 0.406: Q1.12 48.03,21.03 46,19 46,15 46.5,14.5 51.75,14.5 v52,14.25
N$12
  Top 0.254: R38.2 87.33,39.69 87.33,42.55 85.38,44.49 OFFSET.1
N$13
  Bottom 0.254: U2.1 73.5,48.84 77.5,48.84 79.44,50.78 R39.2 79.44,50.89 78.07,52.26 78.07,81.64 76.58,83.12 76.58,84.84 R4.1
N$14
  Top 0.254: Q1.6 41.6,28.72 40.69,28.72 37.28,29.13 34.4,29.63 26.63,21.86 21.03,21.86 V/OCT1.2
  Bottom 0.254: D107.A 11.09,58.55 6.06,58.55 1.49,53.98 1.49,47.81 6.17,43.12 6.17,37.06 6.97,36.26 7.89,36.26 8.69,35.46 8.69,34.09 20.92,21.86 V/OCT1.2
N$15
  Top 0.254: 59.32,9.52 59.32,11.46 59.55,11.69 R10.1 | 59.32,9.52 59.32,8.03 C1.1 | U1.7 73.38,76.27 74.07,76.27 80.58,69.75 HIGH_FREQ.3 | HIGH_FREQ.2 83.1,72.15 80.7,69.75 HIGH_FREQ.3 | 59.32,9.52 67.55,9.52 68.35,10.32 68.35,11.23 71.09,13.97 76.81,13.97 88.47,25.63 88.47,62.78 81.15,70.09 HIGH_FREQ.3
N$16
  Top 0.254: R13.1 59.66,74.55 59.66,76.72 59.89,76.95 R20.2 60.01,77.07 60.01,79.47 R21.2 59.89,79.47 59.89,81.87 R14.2 60.01,81.98 62.64,84.61 62.64,85.3 C13.1
N$17
  Top 0.254: IC2.16 65.84,26.09 65.84,24.72 60.92,19.8 SINE_SYM.1
N$18
  Bottom 0.254: R124.2 11.09,11.12 17.03,11.12 25.15,19.23 25.15,20.15 34.5,29.5 37.5,29.5 38,29 | 40,26 41.42,26 arc45 41.6,26.07 Q1.5 Q1.10
  Bottom 0.305: 38,29 38,28 40,26
N$19  (via drill 0.61)
  Top 0.254: C108.1 2.97,72.38 3.66,72.38 7.43,68.61 HIGH_FREQ1.2 7.43,68.49 5.03,66.09 HIGH_FREQ1.3 4.92,65.98 4.92,58.09 3.77,56.95 v3.77,54.78 | v5.37,53.18 5.37,48.26 3.54,46.43 3.54,11.12 R124.1
  Top 0.813: 2.45,72.71 C108.1
  Bottom 0.254: U3.7 25.03,79.35 26.18,79.35 30.06,83.24 36.01,83.24 36.58,83.81 36.58,87.35 31.66,92.27 13.49,92.27 13.26,92.04 7.32,92.04 6.63,91.35 6.63,89.18 8.46,87.35 8.46,78.44 2.63,72.61 C108.1 | v3.77,54.78 v5.37,53.18
N$20
  Bottom 0.254: IC2.13 65.84,33.63 63.89,33.63 60.35,30.09 SINE_RND.1
N$21
  Top 0.254: IC2.15 65.84,28.6 65.84,28.26 59.55,21.97 59.55,21.75 58.75,20.95 57.04,20.95 55.89,19.8 SINE_SYM.3
N$22
  Bottom 0.254: R5.2 60.01,66.32 60.01,65.64 60.12,65.64 61.72,64.04 61.72,54.44 63.32,52.84 66.41,52.84 67.05,52.94
  Bottom 0.305: 67.05,52.94 71,48.75 71,45 73,44 IC2.8
N$23
  Top 0.254: R19.2 52.46,69.52 52.46,71.92 R18.1
  Bottom 0.254: U2.6 73.38,61.52 71.67,61.52 65.72,67.47 54.41,67.47 52.46,69.41 R19.2
N$24
  Top 0.254: R45.1 86.98,62.66 80.81,62.66 79.44,64.04 73.5,64.04 U2.7
  Bottom 0.254: R9.2 76.01,79.58 76.01,66.67 73.5,64.15 U2.7
N$25
  Top 0.254: R16.2 52.92,61.75 52.69,61.52 52.69,59.24 R15.1 52.81,59.24 56.46,55.58 60.12,55.58 64.35,51.35 U2.13
N$26
  Top 0.254: R45.2 79.55,62.55 79.67,62.44 79.67,58.89 R8.1 79.55,59.01 73.5,59.01 U2.5
N$27
  Top 0.254: IC2.1 73.5,26.2 79.21,26.2 D4.A 79.32,25.98 79.32,28.03 D5.C 79.44,28.15 79.67,28.38 79.67,30.89 R17.1
N$28
  Top 0.254: C2.2 78.52,92.5 73.95,92.5 73.72,92.73 R31.2
N$29
  Bottom 0.254: 54.69,53.01 55.78,51.92 60.35,51.92 Q3.B | 54.69,53.01 48.01,59.69 48.01,69.07 57.04,78.1 60.12,78.1 67.09,85.07 73.61,85.07 R31.1 | 54.69,53.01 55.78,54.09 D6.C
N$30
  Top 0.254: R8.2 87.33,58.78 87.33,55.46 86.75,54.89 R11.1
  Bottom 0.254: R11.1 86.75,54.78 88.47,53.06 88.47,33.29 87.33,32.15 R17.2 87.21,30.89 86.3,29.98 72.58,29.98 71.78,30.77 71.78,32.49 65.95,38.32 65.95,38.78 IC2.11
N$31
  Top 0.406: Q3.C R12.2 IC2.9
N$32
  Top 0.254: C7.2 80.81,36.38 77.15,36.38 74.75,38.78 73.5,38.78 IC2.6
N$33
  Top 0.254: IC2.5 73.5,36.38 75.67,36.38 C7.1
N$34
  Top 0.254: IC2.10 65.84,41.41 62.29,41.41 C9.1
N$35
  Top 0.254: U2.8 65.84,64.15 65.84,64.49 64.47,65.86 64.47,81.78 67.3,84.87 67.55,89.64 D3.C
  Bottom 0.254: D2.A 75.67,89.75 67.67,89.75 D3.C
N$36
  Top 0.254: D3.A 59.89,89.64 59.89,83.47 58.52,82.1 58.52,60.84 60.12,59.24 R15.2
  Bottom 0.254: R41.1 52.58,56.72 57.72,56.72 60.12,59.12 R15.2
N$37  (via drill 0.6)
  Top 0.406: IC1.7 33.03,43.97 34,43 35,43 v38,40
  Bottom 0.406: v38,40 38,39 46,31 49.07,31 Q1.8
N$38
  Top 0.254: R135.1 11.2,61.18 11.2,64.84 10.06,65.98 HIGH_FREQ1.1
N$39
  Top 0.813: D107.C 3.52,61.01 R135.2
N$40
  Top 0.813: R103.2 24.8,31.36 IC1.2
N$41
  Top 0.254: OFFSET1.3 37.72,43.81 40.12,46.21 OFFSET1.2
  Bottom 0.254: R103.1 35.2,31.46 35.2,41.29 37.6,43.69 OFFSET1.3 | OFFSET1.2 40.12,46.32 35.09,51.35 34.75,51.35 R128.1 34.63,51.46 32.12,53.98 24.8,53.98 U4.2
N$42
  Top 0.254: R27.2 43.89,37.86 43.89,40.72 44.23,41.06 44.23,42.2 42.75,43.69 OFFSET1.1
N$43  (via drill 0.6)
  Top 0.254: v28,57.75 R128.2
  Top 0.813: U4.1 26.95,51.52 R128.2
  Bottom 0.254: R118.1 14.63,84.72 14.63,84.04 13.72,83.12 13.72,72.27 23.09,62.89 23,57.75 v28,57.75 | 24.69,51.58 U4.1
N$44
  Top 0.254: R136.2 33.03,57.86 R137.2 33.03,57.98 33.03,58.44 36.8,62.21 37.26,62.21 38.58,63.52 | 38.58,63.52 39.66,62.44 C10.1 | 38.58,63.52 37.83,64.27 37.83,79.7 R142.2
  Top 0.813: R142.2 36.11,80.06 R140.1
N$45
  Top 0.254: IC1.13 17.03,36.26 11.09,36.26 9.94,35.12 SINE_RND1.1
N$46
  Top 0.254: IC1.16 17.03,28.72 14.74,28.72 10.06,24.03 SINE_SYM1.1
N$47
  Top 0.254: IC1.15 17.03,31.23 13.83,31.23 5.77,28.18 5.06,26.18 4.92,24.03 SINE_SYM1.3
N$48
  Top 0.254: IC1.8 24.8,46.55 27.09,46.55 27.32,46.78 R146.2
N$49
  Top 0.813: U4.6 28.23,64.22 R153.2 29.2,66.39 R152.1
N$50
  Top 0.813: U4.7 24.76,67.76 28,71 28.73,71 R149.1
  Bottom 0.254: R150.2 15.09,80.15 15.09,77.64 17.49,75.24 17.83,75.24 22.29,70.78 22.29,69.18 24.69,66.78 U4.7
N$51
  Top 0.254: 28.46,61.06 36.35,68.95 36.35,70.89 R149.2
  Top 0.813: U4.5 27.84,61.68 28.46,61.06 R132.1
N$52  (via drill 0.61)
  Top 0.254: R148.2 13.37,40.15 15.77,40.15 17.03,41.41 IC1.11 | v25.72,50.09 29.49,50.09 36.46,57.06 36.46,60.49 R132.2
  Bottom 0.254: R132.2 36.46,60.61 36.46,62.09 35.32,63.24 35.32,76.15 36.12,76.95 R147.1 | v25.72,50.09 17.14,41.52 IC1.11
N$53
  Top 0.254: D110.A 27.66,27.57 25.95,27.57 24.8,28.72 IC1.1
  Top 0.813: D110.A 28.02,25.49 D111.C
  Bottom 0.254: R148.1 13.37,32.38 21.14,32.38 24.69,28.83 IC1.1
N$54
  Top 0.406: C12.2 16.96,93.04 17,93 18,94 18,94.57 R130.2
N$55
  Top 0.254: 13.5,61.5 12.25,62.75 12.34,62.89 12.34,79.01 | 13.5,57.5 14.25,56.75 14.25,55.75 12.75,54.25 11.56,54.25 Q2.B 11.2,53.63 11.2,51.69 11.89,51.01 11.89,48.72 D109.C | R130.1 17.83,87.01 17.83,86.1 15.77,84.04 15.25,83.75 13.75,83.75
  Top 0.305: 13.5,61.5 13.5,57.5 | 13.75,83.75 13,83 12.34,79.01
N$56
  Bottom 0.254: R154.2 2.52,49.29 3.43,49.29 5.03,50.89 11.43,50.89 12.34,51.81 Q2.C 12.12,51.46 17.03,46.55 IC1.9
N$57
  Bottom 0.254: C14.2 32.23,38.89 28.69,38.89 26.18,41.41 24.8,41.41 IC1.6
N$58
  Top 0.813: IC1.5 C14.1
N$59
  Top 0.254: R129.2 1.6,46.21 1.6,48.61 1.49,48.72 1.49,50.55 6.86,55.92 R133.1
  Bottom 0.254: U4.13 17.03,54.09 14.4,54.09 12.57,55.92 R133.1
N$60
  Bottom 0.406: D113.C 24.5,90.35 D112.A 13.35,90.35 12,89 12,71.9 U4.8
N$61
  Top 0.254: R134.1 45.26,82.9 39.55,82.9 32.92,89.53 D113.A
  Bottom 0.254: R133.2 4.92,56.04 10.06,56.04 12.34,58.32 12.34,70.09 8.91,73.52 8.91,87.7 7.09,89.53 7.09,91.13 7.54,91.58 14.06,91.58 14.29,91.81 30.63,91.81 32.8,89.64 D113.A
N$62
  Top 0.813: C115.1 16.97,44.09 IC1.10
PITCH_CV_1  (via drill 0.61)
  Top 0.254: v48.92,67.92 48.92,36.26 53.15,32.03 53.15,27.23 52.12,26.2 52.25,26.2 52.25,20 51.78,20 R7.1
  Bottom 0.254: v48.92,67.92 48.92,68.15 51.78,71.01 54.52,71.01 59.44,75.92 61.27,75.92 65.27,79.92 73.72,79.92 | 73.72,79.92 74.3,79.35 74.3,78.44 73.27,77.41 66.75,77.41 65.72,76.38 U1.2 | JP1.7 86.07,94.9 84.7,94.9 77.27,87.47 77.27,87.01 76.24,85.98 76.12,85.98 74.52,84.38 74.52,80.84 73.72,80.04 73.72,79.92
PITCH_CV_2  (via drill 0.6, 0.61)
  Top 0.254: v9.14,95.13 14.97,89.3 17.14,89.3 18.97,87.47 18.97,86.55 16.34,83.92 16.34,81.41 17.26,80.5 17.26,79.35 U3.2 | R101.1 39.14,30.36 36.5,33 v33.8,33 | v30.5,52.5 30.5,55 v31.8,56.3
  Bottom 0.254: v9.14,95.13 5.03,95.13 JP3.7 | v33.8,33 33.8,49.2 v30.5,52.5 | v31.8,56.3 31.8,70.2 29.5,72.5 25,72.5 18.2,79.3 17.39,79.3 U3.2
SINE_TRI_OUT_1
  Top 0.254: R4.2 84.12,84.84 86.07,84.84 JP1.3
SINE_TRI_OUT_2
  Top 0.813: JP3.3 6.91,84.98 R118.2
SKEW_IN_1  (via drill 0.61)
  Top 0.254: JP1.5 86.07,89.75 83.44,89.75 D2.C 83.33,89.64 83.33,88.38 77.15,82.21 v77.15,80.5 | 64.35,59.92 65.84,61.41 U2.9 | 64.35,59.92 61.15,56.72 60.24,56.72 R41.2 | 64.35,59.92 60.24,64.04 R44.1
  Bottom 0.254: v77.15,80.5 77.15,63.12 74.52,60.49 66.86,60.49 65.95,61.41 U2.9
SKEW_IN_2
  Top 0.813: JP3.5 7.87,90.06 D112.C | R155.1 36.34,84.25 R134.2
  Bottom 0.254: 9.37,89.18 9.37,73.75 12.8,70.32 12.8,68.95 17.03,64.72 17.03,64.27 U4.9 | 9.37,89.18 8.23,90.33 D112.C | R155.1 35.55,84.27 32.46,84.27 25.38,91.35 14.52,91.35 14.06,90.9 11.2,90.9 9.49,89.18 9.37,89.18
SQR_OUT_1
  Top 0.254: R9.1 83.67,79.7 83.67,82.1 R6.2 83.78,82.21 86.07,82.21 JP1.2
SQR_OUT_2
  Top 0.813: JP3.2 6.82,82.44 R151.2 7.41,82.47 R150.1
SW_1_1
  Top 0.254: R21.1 52.35,79.47 48.81,79.47 45.61,76.27 JP2.10
SW_1_2
  Top 0.254: R137.1 40.58,57.98 40.58,58.55 45.49,63.47 JP2.5
SW_2_1
  Bottom 0.254: IC2.3 73.5,31.23 73.5,31.69 76.81,35.01 76.81,40.15 74.07,42.89 64.12,42.89 47.32,59.69 47.32,71.81 45.61,73.52 JP2.9
SW_2_2  (via drill 0.61)
  Top 0.254: v42.86,41.63 35.09,33.86 24.8,33.86 IC1.3
  Bottom 0.254: v42.86,41.63 42.86,42.2 44.23,43.58 44.23,59.58 45.49,60.84 JP2.4
SW_3_1
  Top 0.254: R20.1 52.23,76.95 51.44,76.95 45.61,71.12 JP2.8
SW_3_2
  Top 0.254: R136.1 40.69,55.12 42.29,55.12 45.49,58.32 JP2.3
SW_4_1
  Top 0.254: SINE_RND.3 55.32,30.09 57.72,32.49 SINE_RND.2 57.72,32.6 50.75,39.58 50.75,67.35 49.26,68.84 48.58,68.84 48.35,68.61 45.61,68.61 JP2.7
SW_4_2  (via drill 0.61)
  Top 0.254: SINE_RND1.3 4.92,35.12 7.32,37.52 SINE_RND1.2 | v21.14,35.35 25.83,35.35 26.4,35.92 26.4,36.72 25.72,37.41 24.12,37.41 22.52,39.01 22.52,46.43 23.89,47.81 35.66,47.81 43.66,55.81 45.49,55.81 JP2.2
  Bottom 0.254: v21.14,35.35 11.32,35.35 9.14,37.52 7.43,37.52 SINE_RND1.2
SW_5_1  (via drill 0.61)
  Top 0.254: v56.12,40.95 65.84,31.23 IC2.14
  Bottom 0.254: v56.12,40.95 56.12,50.21 46.86,59.47 46.86,64.72 45.61,65.98 JP2.6
SW_5_2  (via drill 0.61)
  Top 0.254: v27.32,36.72 27.32,37.52 28.23,38.43 28.23,39.35 27.2,40.38 23.66,40.38 22.97,41.06 22.97,44.38 24,45.41 37.6,45.41 45.49,53.29 JP2.1
  Bottom 0.254: v27.32,36.72 25.95,35.35 24.12,35.35 22.63,33.86 17.14,33.86 IC1.14
SYNC_IN_1
  Top 0.254: C2.1 83.67,92.5 86.07,92.5 JP1.6
SYNC_IN_2
  Top 0.813: JP3.6 7.31,92.6 C12.1

### Text on the board
tNames: Designed by Zack Hagan / zhagan@gmail.com / May 2017 - Feb 2018 | XR-VCO x 2
bNames: XR-VCO x 2